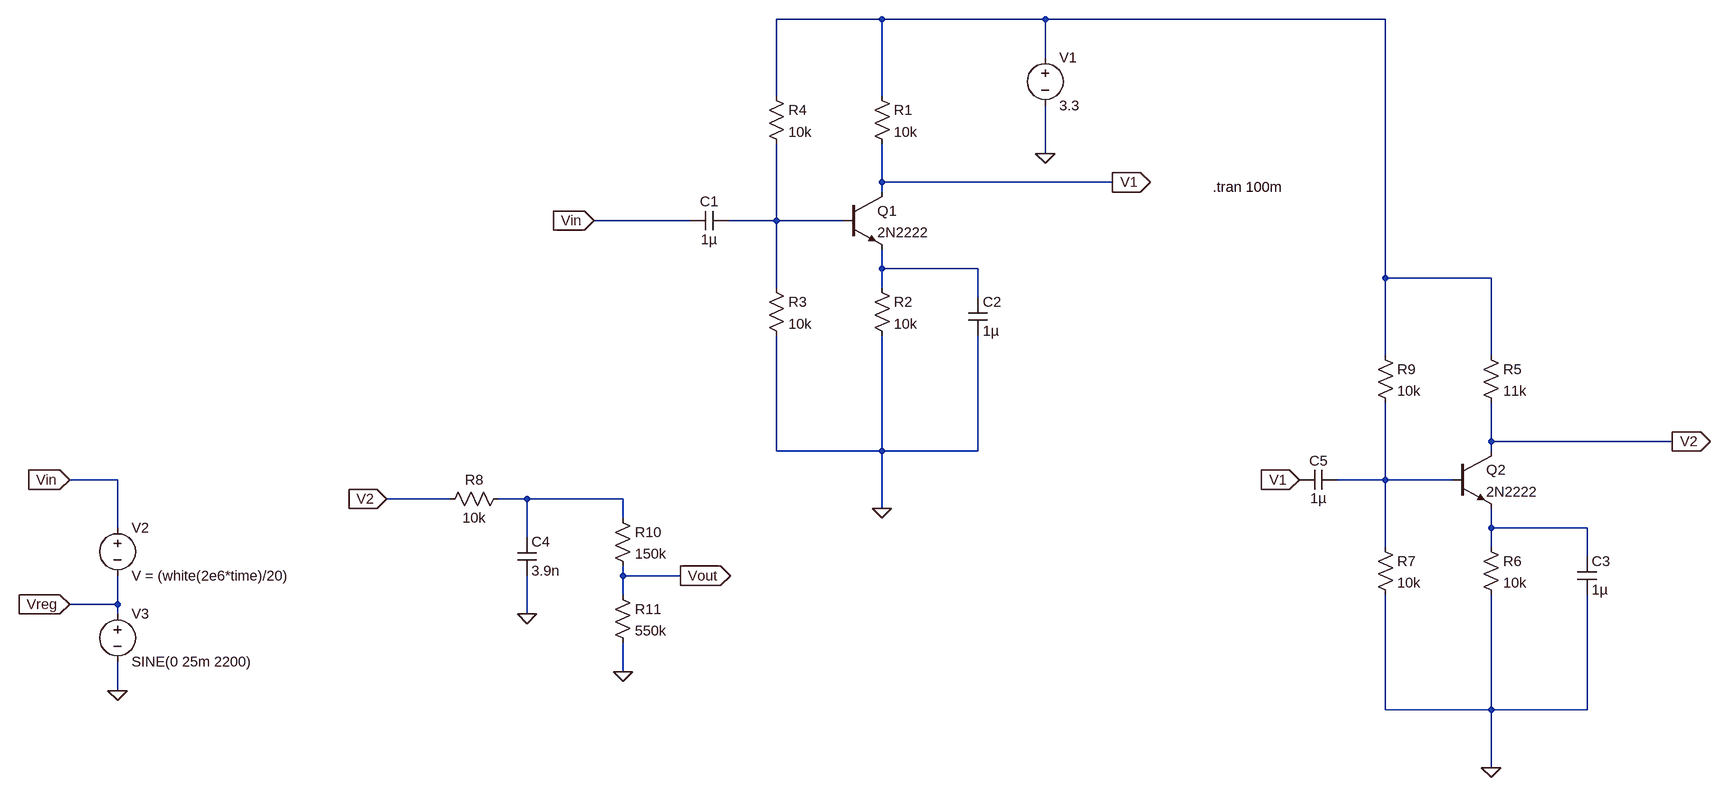
[diagram p0: schematic Rx_circuit3.asc]
Rx_circuit3.asc, the LTspice schematic file:
Version 4
SHEET 1 1648 1028
WIRE 80 -240 -96 -240
WIRE 352 -240 80 -240
WIRE 976 -240 352 -240
WIRE 352 -176 352 -240
WIRE -96 -112 -96 -240
WIRE 80 -112 80 -240
WIRE 352 -16 352 -96
WIRE 80 32 80 -32
WIRE 464 32 80 32
WIRE 80 48 80 32
WIRE -240 96 -400 96
WIRE -96 96 -96 -32
WIRE -96 96 -176 96
WIRE 16 96 -96 96
WIRE 80 176 80 144
WIRE 240 176 80 176
WIRE 976 192 976 -240
WIRE 1152 192 976 192
WIRE -96 208 -96 96
WIRE 80 208 80 176
WIRE 240 224 240 176
WIRE 976 320 976 192
WIRE 1152 320 1152 192
WIRE 1152 464 1152 400
WIRE 1536 464 1152 464
WIRE -96 480 -96 288
WIRE 80 480 80 288
WIRE 80 480 -96 480
WIRE 240 480 240 288
WIRE 240 480 80 480
WIRE 1152 480 1152 464
WIRE -1648 528 -1728 528
WIRE 976 528 976 400
WIRE 976 528 896 528
WIRE 1088 528 976 528
WIRE -640 560 -784 560
WIRE -512 560 -560 560
WIRE -352 560 -512 560
WIRE 80 576 80 480
WIRE -352 592 -352 560
WIRE -1648 608 -1648 528
WIRE 1152 608 1152 576
WIRE 1312 608 1152 608
WIRE -512 624 -512 560
WIRE 976 640 976 528
WIRE 1152 640 1152 608
WIRE 1312 656 1312 608
WIRE -352 688 -352 672
WIRE -256 688 -352 688
WIRE -352 720 -352 688
WIRE -1648 736 -1648 688
WIRE -1648 736 -1728 736
WIRE -1648 752 -1648 736
WIRE -512 752 -512 688
WIRE -352 848 -352 800
WIRE -1648 880 -1648 832
WIRE 976 912 976 720
WIRE 1152 912 1152 720
WIRE 1152 912 976 912
WIRE 1312 912 1312 720
WIRE 1312 912 1152 912
WIRE 1152 1008 1152 912
FLAG 352 -16 0
FLAG 80 576 0
FLAG 464 32 V1
IOPIN 464 32 Out
FLAG -1728 528 Vin
IOPIN -1728 528 In
FLAG -512 752 0
FLAG -784 560 V2
IOPIN -784 560 In
FLAG -256 688 Vout
IOPIN -256 688 Out
FLAG -400 96 Vin
IOPIN -400 96 In
FLAG -1648 880 0
FLAG -1728 736 Vreg
IOPIN -1728 736 In
FLAG 1152 1008 0
FLAG 1536 464 V2
IOPIN 1536 464 Out
FLAG 832 528 V1
IOPIN 832 528 In
FLAG -352 848 0
DATAFLAG -512 560 ""
DATAFLAG -496 560 ""
DATAFLAG -688 560 ""
DATAFLAG -512 560 ""
DATAFLAG -480 560 ""
DATAFLAG -512 592 ""
DATAFLAG -512 592 ""
SYMBOL npn 16 48 R0
SYMATTR InstName Q1
SYMATTR Value 2N2222
SYMBOL res 64 -128 R0
SYMATTR InstName R1
SYMATTR Value 10k
SYMBOL res 64 192 R0
SYMATTR InstName R2
SYMATTR Value 10k
SYMBOL res -112 192 R0
SYMATTR InstName R3
SYMATTR Value 10k
SYMBOL res -112 -128 R0
SYMATTR InstName R4
SYMATTR Value 10k
SYMBOL cap 224 224 R0
SYMATTR InstName C2
SYMATTR Value 1µ
SYMBOL cap -176 80 R90
WINDOW 0 0 32 VBottom 2
WINDOW 3 32 32 VTop 2
SYMATTR InstName C1
SYMATTR Value 1µ
SYMBOL voltage 352 -192 R0
WINDOW 123 0 0 Left 0
WINDOW 39 0 0 Left 0
SYMATTR InstName V1
SYMATTR Value 3.3
SYMBOL voltage -1648 592 R0
SYMATTR InstName V2
SYMATTR Value V = (white(2e6*time)/20)
SYMATTR Prefix B
SYMBOL res -544 544 R90
WINDOW 0 0 56 VBottom 2
WINDOW 3 32 56 VTop 2
SYMATTR InstName R8
SYMATTR Value 10k
SYMBOL cap -528 624 R0
SYMATTR InstName C4
SYMATTR Value 3.9n
SYMBOL voltage -1648 736 R0
WINDOW 123 0 0 Left 0
WINDOW 39 0 0 Left 0
SYMATTR InstName V3
SYMATTR Value SINE(0 25m 2200)
SYMBOL npn 1088 480 R0
SYMATTR InstName Q2
SYMATTR Value 2N2222
SYMBOL res 1136 304 R0
SYMATTR InstName R5
SYMATTR Value 11k
SYMBOL res 1136 624 R0
SYMATTR InstName R6
SYMATTR Value 10k
SYMBOL res 960 624 R0
SYMATTR InstName R7
SYMATTR Value 10k
SYMBOL res 960 304 R0
SYMATTR InstName R9
SYMATTR Value 10k
SYMBOL cap 1296 656 R0
SYMATTR InstName C3
SYMATTR Value 1µ
SYMBOL cap 896 512 R90
WINDOW 0 0 32 VBottom 2
WINDOW 3 32 32 VTop 2
SYMATTR InstName C5
SYMATTR Value 1µ
SYMBOL res -368 576 R0
SYMATTR InstName R10
SYMATTR Value 150k
SYMBOL res -368 704 R0
SYMATTR InstName R11
SYMATTR Value 550k
TEXT 688 40 Left 2 !.tran 100m

The netlist it stands for:
* Rx_circuit3.asc
Q1 V1 N002 N003 0 2N2222
R1 N001 V1 10k
R2 N003 0 10k
R3 N002 0 10k
R4 N001 N002 10k
C2 N003 0 1µ
C1 N002 Vin 1µ
V1 N001 0 3.3
B§V2 Vin Vreg V = (white(2e6*time)/20)
R8 N005 V2 10k
C4 N005 0 3.9n
V3 Vreg 0 SINE(0 25m 2200)
Q2 V2 N004 N006 0 2N2222
R5 N001 V2 11k
R6 N006 0 10k
R7 N004 0 10k
R9 N001 N004 10k
C3 N006 0 1µ
C5 N004 V1 1µ
R10 N005 Vout 150k
R11 Vout 0 550k
.model NPN NPN
.model PNP PNP
.lib standard.bjt
.tran 100m
.backanno
.end